# EAGLE design TEST_BATT_PANEL (EAGLE 9.6.2)
COMPANY: ADAFRUIT INDUSTRIES; DRAWN: KTOWN; REV: B
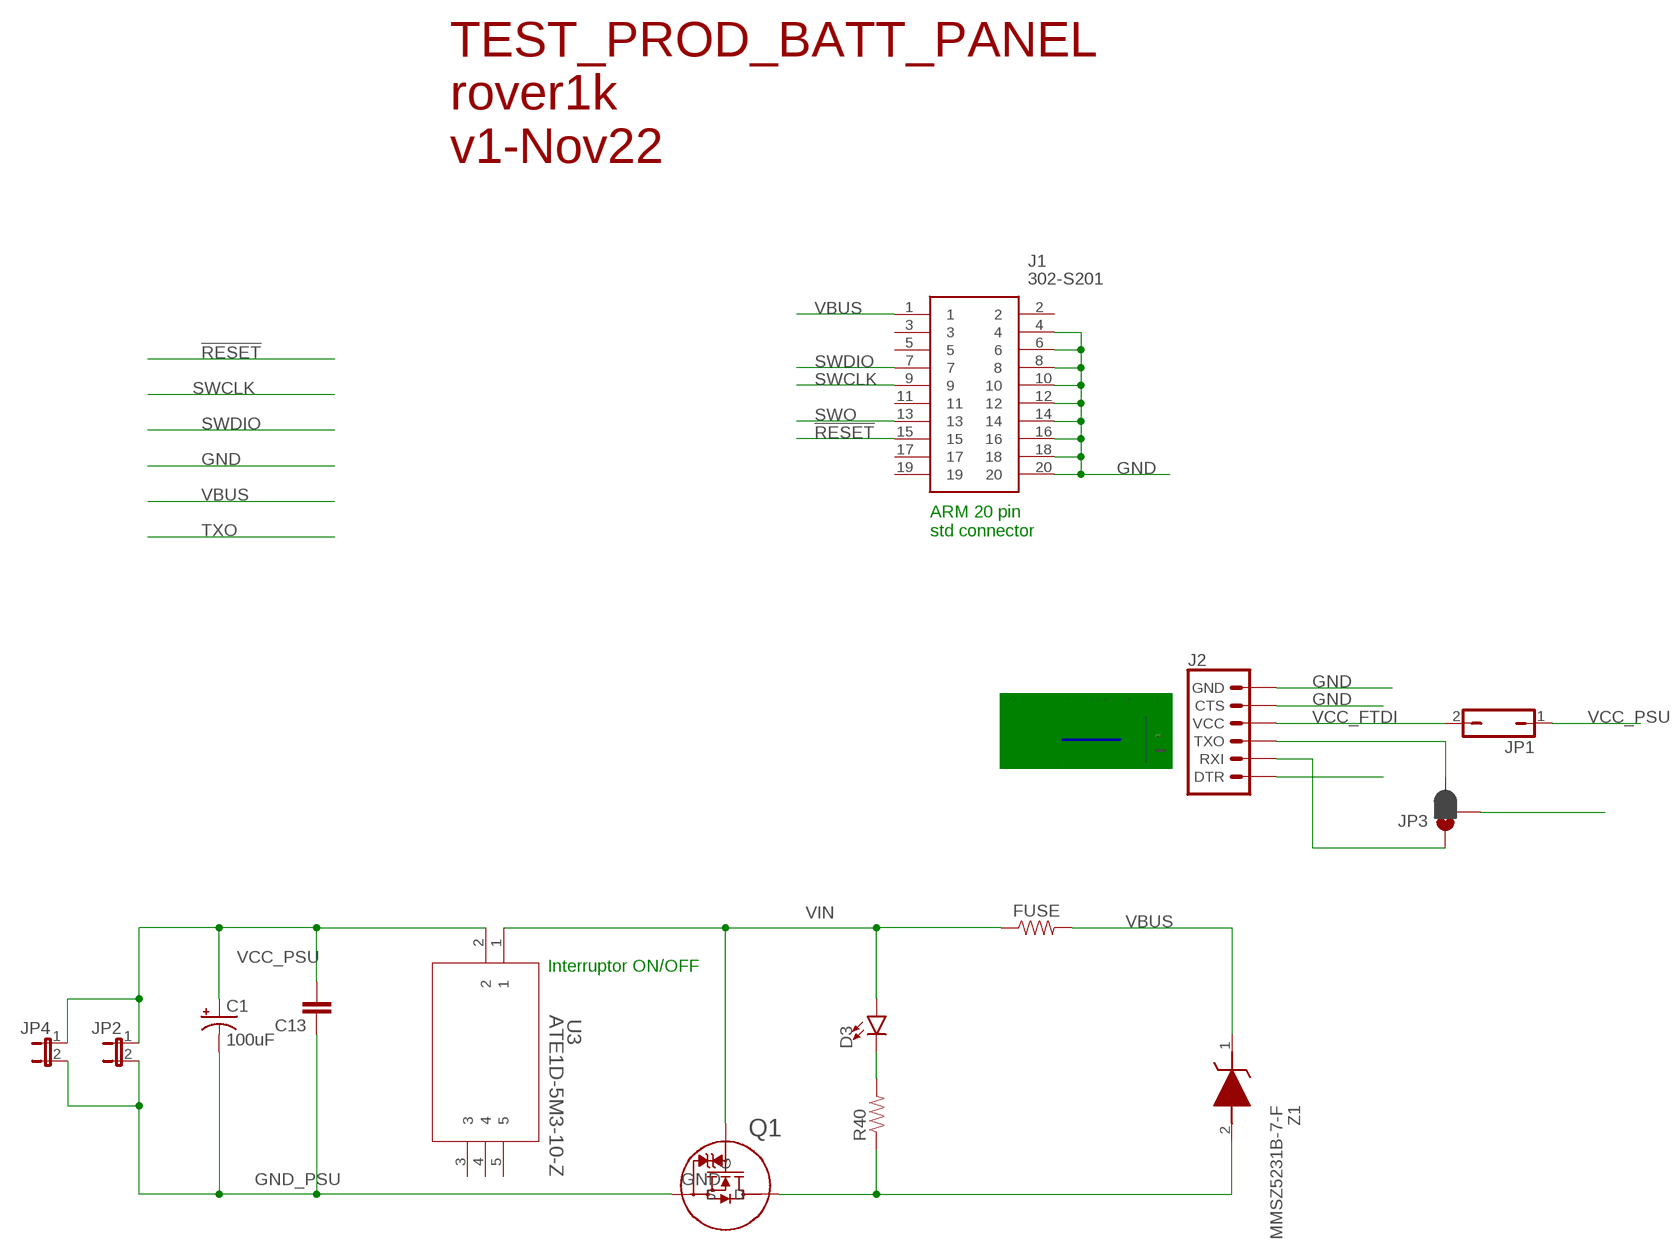
[diagram p0: schematic, sheet 1]

## Parts
C1  100uF  100UF-POLAR-RADIAL-2.5MM-25V-20%  [CPOL-RADIAL-2.5MM-6.5MM]
C13  C-EUC0805  [C0805]
D3  LED3MM  [LED_3MM]
FUSE  RESISTOR0805  [0805]
J1  302-S201  [SHDR20W66P254_2X10_3300X905X90]
J2  6_PIN_SERIAL_TARGET  [1X06]
JP1  JP1Q  [JP1]
JP2  JP1E  [JP1]
JP3  JUMPER-SMT_3_1-NC_PASTE_NO-SILK  [SMT-JUMPER_3_1-NC_PASTE_NO-SILK]
JP4  JP1E  [JP1]
Q1  PJA3416AE_R1_00001  [SOT23_PJA3416_PNJ]
R40  10K  RESISTOR0805-RES  [0805]
U3  ATE1D-5M3-10-Z  [SPDT05_ATE1D_9P5X8_NDC]
Z1  MMSZ5231B-7-F  [SOD3716X145N]

## Nets
!RESET: J1.15
GND: J1.4 J1.6 J1.8 J1.10 J1.12 J1.14 J1.16 J1.18 J1.20 J2.5(CTS) J2.6(GND) Q1.3(D) R40.1 Z1.2(A)
GND_PSU: C1.2(-) C13.1 JP2.2 JP4.2 Q1.2(S)
N$1: J2.1(DTR)
N$2: J2.2(RXI) JP3.1
N$3: J2.3(TXO) JP3.3
N$28: D3.K(C) R40.2
SWCLK: J1.9
SWDIO: J1.7
SWO: J1.13
TXO: JP3.2
VBUS: FUSE.2 J1.1 Z1.1(K)
VCC_FTDI: J2.4(VCC) JP1.2
VCC_PSU: C1.1(+) C13.2 JP1.1 JP2.1 JP4.1 U3.2
VIN: D3.A FUSE.1 Q1.1(G) U3.1
Unconnected: J1.2 J1.3 J1.5 J1.11 J1.17 J1.19 U3.3 U3.4 U3.5

## Notes on the sheet
- TEST_PROD_BATT_PANEL
  rover1k
  v1-Nov22
- ARM 20 pin
  std connector
- Interruptor ON/OFF

## Library data of the parts
C1 = SparkFun-Capacitors:100UF-POLAR: 100µF polarized capacitors A capacitor is a passive two-terminal electrical component used to store electrical energy temporarily in an electric field.; PROD_ID: CAP-08439
C13 = rcl:C-EU: CAPACITOR, European symbol; SPICEPREFIX: C
D3 = SparkFun-LED:LED: LED (Generic) Standard schematic elements and footprints for 5mm, 3mm, 1206, and 0603 sized LEDs. Generic LEDs with no color specified.; PROD_ID: DIO-08794
FUSE = SparkFun-Resistors:RESISTOR: Generic Resistor Package
J1 = 302-S201:302-S201: CONN HEADER VERT 20POS GOLD Source: Datasheet <http://www.on-shore.com/wp-content/uploads/2018/04/302-SXX1.pdf>; DESCRIPTION: CONN HEADER VERT 20POS GOLD; HEIGHT: 9.05mm; MANUFACTURER_NAME: On Shore Technology Inc.; MANUFACTURER_PART_NUMBER: 302-S201
J2 = SparkFun-Connectors:6_PIN_SERIAL_TARGET: 6-pin header connection for use with the "FTDI BASIC" pinout - TARGET SIDE. Also known as "Arduino Serial Program Header". It is used to mate with our FTDI Basic serial programmers using the Arduino IDE. Note, this device has "TARGET" in the name. It is intended to be used on a design that contains a target micro-controller that you wish to program. The "sister" device, named "CABLE" is inteneded to be used on a design that usually lives on the end of your USB cable and prvides the converter chip (FTDI232 or FTDI231x) to commnicate serial RX/TX. You can populate with some of these: Break Away Headers - Straight <https://www.sparkfun.com/products/116> (PRT-00116) For reference (or to suit your programming needs) check out these designs: SparkFun FTDI Basic Breakout - 5V <https://www.sparkfun.com/products/9716> (DEV-09716) SparkFun FTDI Basic Breakout - 3.3V <https://www.sparkfun.com/products/9873> (DEV-09873) SparkFun FTDI SmartBasic <https://www.sparkfun.com/products/12935> (DEV-12935) SparkFun Beefy 3 - FTDI Basic Breakout <https://www.sparkfun.com/products/13746> (DEV-13746)
JP1 = jumper:JP1Q: JUMPER
JP2 JP4 = jumper:JP1E: JUMPER
JP3 = SparkFun-Jumpers:JUMPER-SMT_3_1-NC_PASTE: Normally closed solder jumper (1 of 2 connections) This jumper has an aperture in the stencil to allow solder paste to bridge one of the two connections. One connection is normally closed (NC), while the other is normally open (NO). Wick off the solder to open the connection. Reapply solder to reclose the connection. Apply solder to the other side instead to change the current path.
Q1 = PJA3416AE_R1_00001:PJA3416AE_R1_00001; COPYRIGHT: Copyright (C) 2022 Ultra Librarian. All rights reserved.; DIGI-KEY_PART_NUMBER_1: 3757-PJA3416AE_R1_00001TR-ND; DIGI-KEY_PART_NUMBER_2: 3757-PJA3416AE_R1_00001CT-ND; DIGI-KEY_PART_NUMBER_3: 3757-PJA3416AE_R1_00001DKR-ND; MANUFACTURER_PART_NUMBER: PJA3416AE_R1_00001; MFR_NAME: Panjit
R40 = SparkFun:RESISTOR: Resistor Basic schematic elements and footprints for 0603, 1206, and PTH resistors.
U3 = ATE1D-5M3-10-Z:ATE1D-5M3-10-Z; COPYRIGHT: Copyright (C) 2022 Ultra Librarian. All rights reserved.; DIGI-KEY_PART_NUMBER_1: 563-1158-ND; MANUFACTURER_PART_NUMBER: ATE1D-5M3-10-Z; MFR_NAME: Nidec Copal Electronics
Z1 = MMSZ5231B-7-F:MMSZ5231B-7-F: Zener Diode 5.1V 5% 500mW SOD123 Diodes Inc MMSZ5231B-7-F Zener Diode, 5.1V 5% 0.5 W SMT 2-Pin SOD-123 Source: Datasheet <https://www.diodes.com/assets/Datasheets/ds18010.pdf>; ARROW_PART_NUMBER: MMSZ5231B-7-F; ARROW_PRICE-STOCK: null?region=asia; DESCRIPTION: Zener Diode 5.1V 5% 500mW SOD123 Diodes Inc MMSZ5231B-7-F Zener Diode, 5.1V 5% 0.5 W SMT 2-Pin SOD-123; HEIGHT: 1.45mm; MANUFACTURER_NAME: Diodes Inc.; MANUFACTURER_PART_NUMBER: MMSZ5231B-7-F; MOUSER_PART_NUMBER: 621-MMSZ5231B-F; MOUSER_PRICE-STOCK: https://www.mouser.co.uk/ProductDetail/Diodes-Incorporated/MMSZ5231B-7-F?qs=2ygBApjwyeMh7Sf0YL1qSw%3D%3D

## Net classes
2 gnd: width 0.305 mm, drill 0.483 mm, clearance 0.203 mm

## Board
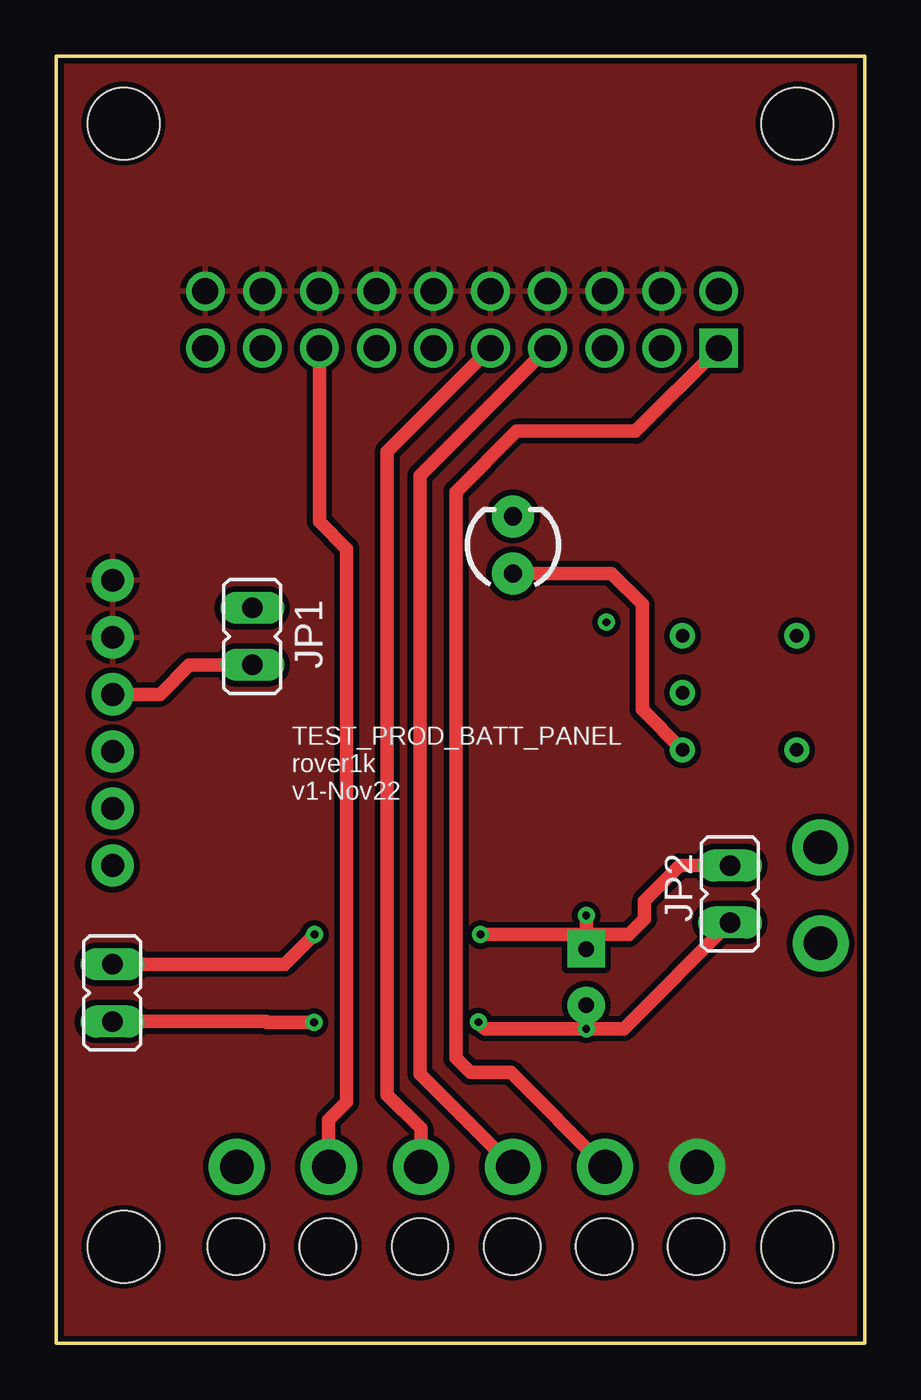
[diagram p1: board, top side]
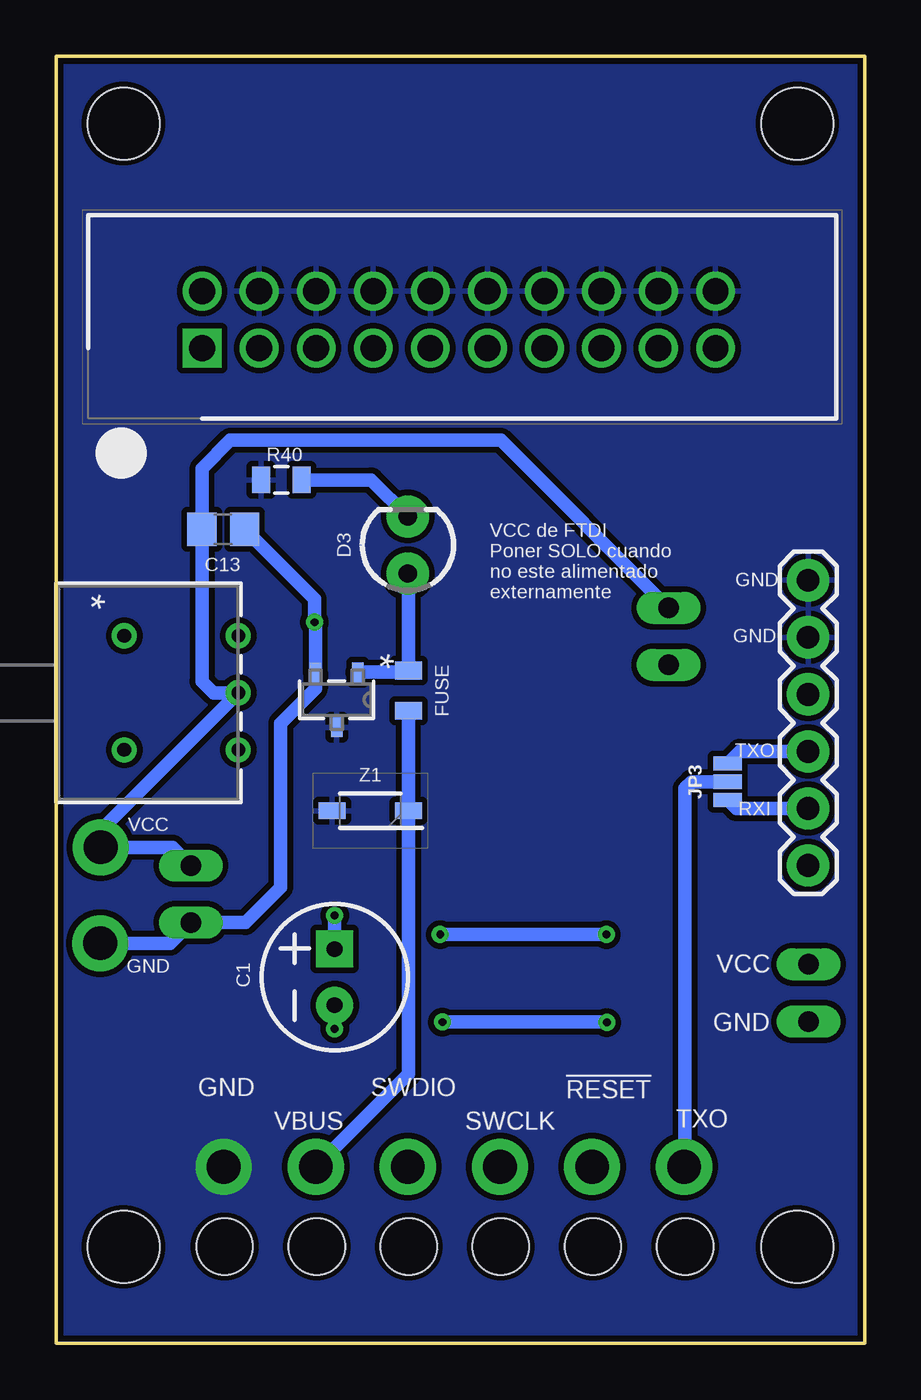
[diagram p2: board, bottom side, seen from below]

Size 36 x 57.3 mm. Coordinates in mm from the lower left corner, seen from the top.
Outline: 0,0 36,0 36,57.3 0,57.3 0,0
Copper layers (1*16): Top 0.035mm / dielectric 1.5mm / Bottom 0.035mm
Design rules "adafruit *": minimum track width 8mil, minimum drill 0.25mm, track to track 8mil, track to pad 8mil, pad to pad 8mil, via to via 8mil, smd to smd 5mil, copper to edge 10mil, drill to drill 8mil, minimum pad ring 10mil, minimum via ring 8mil, stop-mask expansion 2mil, vias tented up to drill 20mil, thermal gap 10mil
Holes 3.2 mm at 3,54.3 33,54.3 3,4.3 33,4.3
Holes 2.5 mm at 28.5,4.3 24.4,4.3 20.3,4.3 12.1,4.3 8,4.3 16.2,4.3

### Footprints (pad centres in the part's own frame; a part is rotated, then mirrored left to right if it is on the bottom)
CPOL-RADIAL-2.5MM-6.5MM = drill 0.7 pad 1.651 square: 1 1.25,0 | drill 0.7 pad 1.651: 2 -1.25,0
C0805 = smd 1.3 x 1.5: 1 -0.95,0; 2 0.95,0
LED_3MM = drill 0.813 pad 1.88: A -1.27,0; K 1.27,0
0805 = smd 0.8 x 1.2: 1 -0.9,0; 2 0.9,0
SHDR20W66P254_2X10_3300X905X90 = drill 1.15 pad 1.725 square: 1 0,0 | drill 1.15 pad 1.725: 2 0,2.54; 3 2.54,0; 4 2.54,2.54; 5 5.08,0; 6 5.08,2.54; 7 7.62,0; 8 7.62,2.54; 9 10.16,0; 10 10.16,2.54; 11 12.7,0; 12 12.7,2.54; 13 15.24,0; 14 15.24,2.54; 15 17.78,0; 16 17.78,2.54; 17 20.32,0; 18 20.32,2.54; 19 22.86,0; 20 22.86,2.54
1X06 = drill 1.016 pad 1.88: 1 0,0; 2 2.54,0; 3 5.08,0; 4 7.62,0; 5 10.16,0; 6 12.7,0
JP1 = drill 0.914 long: 1 0,-1.27; 2 0,1.27
SMT-JUMPER_3_1-NC_PASTE_NO-SILK = smd 0.635 x 1.27: 1 -0.813,0; 2 0,0; 3 0.813,0
SOT23_PJA3416_PNJ = smd 0.864 x 0.508: 1 -1.232,0.95; 2 -1.232,-0.95; 3 1.232,0
SPDT05_ATE1D_9P5X8_NDC = drill 0.61 pad 1.118: 1 5.08,5.08; 2 2.54,5.08; 3 0,5.08; 4 0,0; 5 5.08,0
SOD3716X145N = smd 1.2 x 0.75: 1 -1.7,0; 2 1.7,0

### Placement (x,y rotation side)
C1  23.6,16.3 90 bottom
C13  28.56,36.24 180 bottom
D3  20.34,35.54 90 bottom
FUSE  20.31,29.06 270 bottom
J1  29.5,44.3 0 bottom
J2  2.52,21.27 90 bottom
JP1  8.73,31.47 180 top
JP2  30,20 180 top
JP3  6.1,25 90 bottom
JP4  2.5,15.6 180 top
Q1  23.51,28.65 270 bottom
R40  25.97,38.44 0 bottom
U3  32.97,31.5 270 bottom
Z1  22.01,23.71 180 bottom

### Tracks (layer width: path | path; a pad name or v marks a point on that pad's centre or on a via)
!RESET  (via drill 1.5 pad 2.5)
  Top 0.61: J1.15 11.72,36.58 12.94,35.36 12.94,10.76 12.14,9.96 v12.14,7.86
GND  (via drill 1.5 pad 2.5)
  other vias: 28.54,7.86
  pour Top (isolate 0.254): -2,58.8 38.11,58.8 38.11,-1.2 -2,-1.2
  pour Bottom (isolate 0.254): -1.5,58.3 38.37,58.3 38.37,-0.7 -1.5,-0.7
GND_PSU  (via drill 0.35, 1.5 pad 2.5)
  Top 0.61: JP2.2 25.27,14 v23.6,14 19.1,14 v18.8,14.3 | JP4.2 9.34,14.33 9.39,14.28 v11.48,14.28
  Bottom 0.61: v34.04,17.81 30.92,17.81 JP2.2 27.57,18.73 26,20.3 26,27.6 24.46,29.14 Q1.2 24.46,32.06 v24.5,32.1 24.5,33.13 C13.1 | v18.8,14.3 11.5,14.3 v11.48,14.28 | C1.2 v23.6,14
N$2
  Bottom 0.61: JP3.1 5.72,23.81 J2.2
N$3
  Bottom 0.61: JP3.3 5.56,26.35 J2.3
N$28
  Bottom 0.61: R40.2 21.97,38.44 D3.K
SWCLK  (via drill 1.5 pad 2.5)
  Top 0.61: J1.9 14.74,39.7 14.74,11.06 16.24,9.56 v16.24,7.86
SWDIO  (via drill 1.5 pad 2.5)
  Top 0.61: v20.34,7.86 16.2,12 16.2,38.62 J1.7
TXO  (via drill 1.5 pad 2.5)
  Bottom 0.61: JP3.2 7.7,25 8,24.7 8,7.9 v8.04,7.86
VBUS  (via drill 1.5 pad 2.5)
  Top 0.61: J1.1 25.8,40.6 20.5,40.6 17.8,37.9 17.8,12.7 18.44,12.06 20.24,12.06 v24.44,7.86
  Bottom 0.61: FUSE.2 Z1.1 20.31,11.99 v24.44,7.86
VCC_FTDI
  Top 0.61: JP1.2 5.93,30.2 4.62,28.89 J2.4
VCC_PSU  (via drill 0.35, 1.5 pad 2.5)
  Top 0.61: v11.5,18.2 10.17,16.87 JP4.1 | v18.9,18.2 23.6,18.2 | 23.6,18.2 25.5,18.2 26.2,18.9 26.2,19.7 27.77,21.27 JP2.1 | v23.6,19.05 23.6,18.2
  Bottom 0.61: JP2.1 30.81,22.08 v34.02,22.08 34.02,22.83 U3.2 28.99,28.96 29.5,29.47 C13.2 29.51,38.94 28.25,40.2 16.2,40.2 JP1.1 | v11.5,18.2 v18.9,18.2 | C1.1 v23.6,19.05
VIN
  Top 0.61: U3.1 26.1,28.21 26.1,32.9 24.73,34.27 D3.A
  Bottom 0.61: Q1.1 20.39,29.88 FUSE.1 20.31,34.24 D3.A

### Text on the board
tNames: TEST_PROD_BATT_PANEL / rover1k / v1-Nov22
bNames: VCC de FTDI / Poner SOLO cuando / no este alimentado / externamente | GND | GND | TXO | RXI | VCC | VCC | GND | GND | !RESET | SWDIO | GND | TXO | SWCLK | VBUS